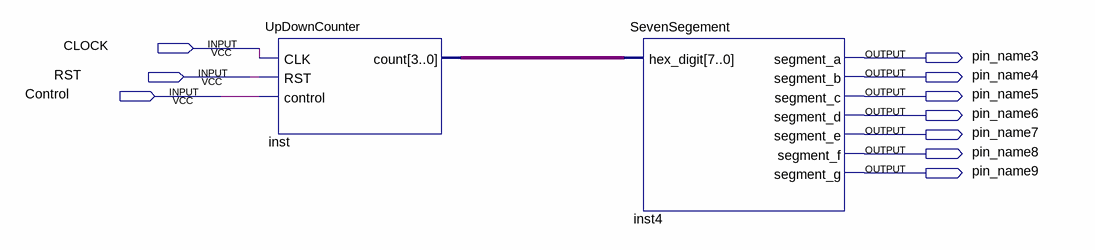
[diagram p0: schematic sheet]
// Quartus schematic Block1.bdf as structural Verilog: 2 symbols, 10 pins
module Block1 (
  input  CLOCK,
  input  RST,
  input  Control,
  output pin_name3,
  output pin_name4,
  output pin_name5,
  output pin_name6,
  output pin_name7,
  output pin_name8,
  output pin_name9
);

  wire [7:0] inst_count;

  UpDownCounter inst (.CLK(CLOCK), .RST(RST), .control(Control), .count(inst_count));
  SevenSegement inst4 (
    .hex_digit(inst_count), .segment_a(pin_name3), .segment_b(pin_name4), .segment_c(pin_name5),
    .segment_d(pin_name6), .segment_e(pin_name7), .segment_f(pin_name8), .segment_g(pin_name9));
endmodule
